# EAGLE design R141E (EAGLE 6.6.0)
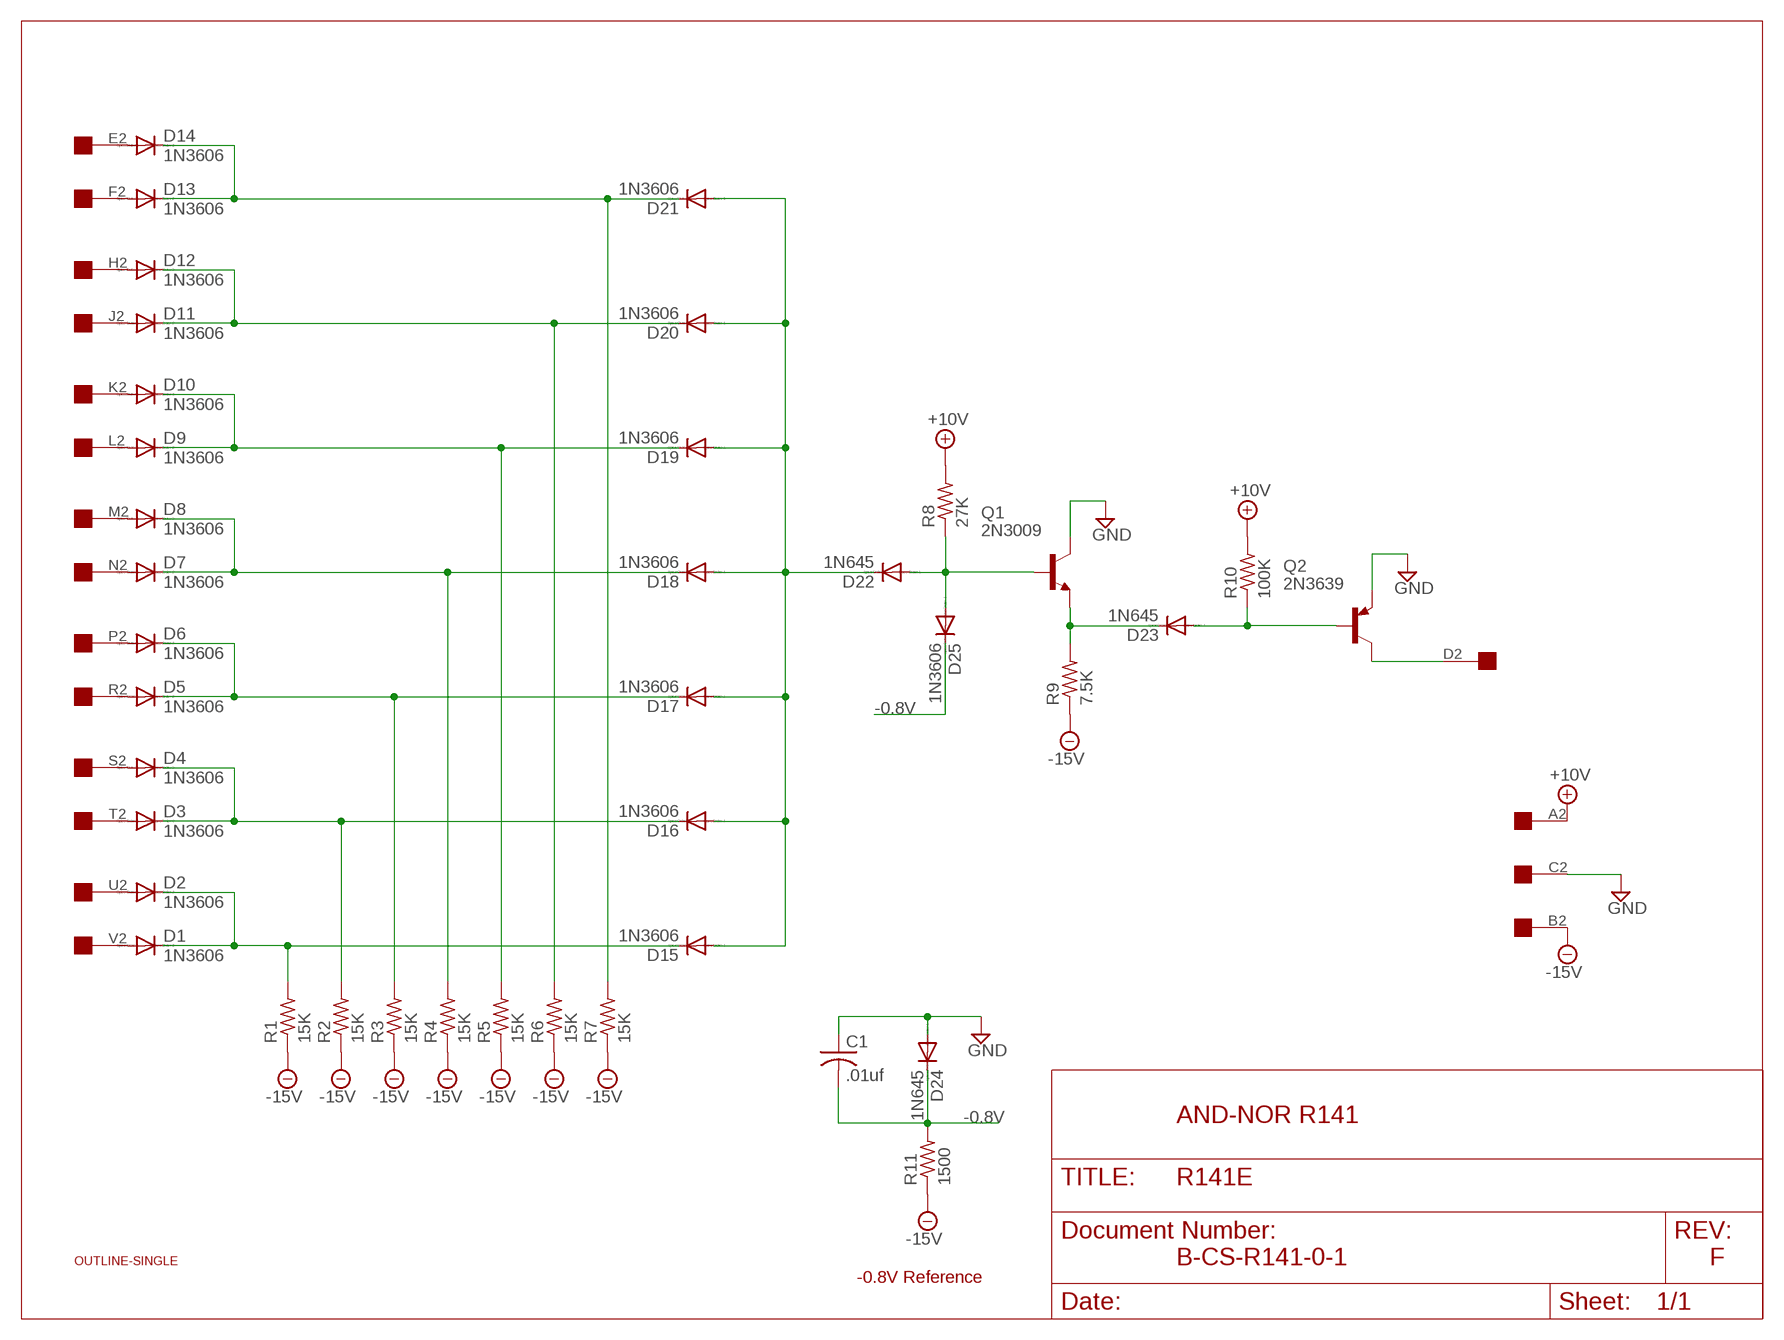
[diagram p0: schematic, sheet 1]

## Parts
C1  .01uf  C-US050-025X075  [C050-025X075]
D1  1N3606  1N4148DO35-10  [DO35-10]
D2  1N3606  1N4148DO35-10  [DO35-10]
D3  1N3606  1N4148DO35-10  [DO35-10]
D4  1N3606  1N4148DO35-10  [DO35-10]
D5  1N3606  1N4148DO35-10  [DO35-10]
D6  1N3606  1N4148DO35-10  [DO35-10]
D7  1N3606  1N4148DO35-10  [DO35-10]
D8  1N3606  1N4148DO35-10  [DO35-10]
D9  1N3606  1N4148DO35-10  [DO35-10]
D10  1N3606  1N4148DO35-10  [DO35-10]
D11  1N3606  1N4148DO35-10  [DO35-10]
D12  1N3606  1N4148DO35-10  [DO35-10]
D13  1N3606  1N4148DO35-10  [DO35-10]
D14  1N3606  1N4148DO35-10  [DO35-10]
D15  1N3606  1N4148DO35-10  [DO35-10]
D16  1N3606  1N4148DO35-10  [DO35-10]
D17  1N3606  1N4148DO35-10  [DO35-10]
D18  1N3606  1N4148DO35-10  [DO35-10]
D19  1N3606  1N4148DO35-10  [DO35-10]
D20  1N3606  1N4148DO35-10  [DO35-10]
D21  1N3606  1N4148DO35-10  [DO35-10]
D22  1N645  1N4148DO35-10  [DO35-10]
D23  1N645  1N4148DO35-10  [DO35-10]
D24  1N645  1N4148DO35-10  [DO35-10]
D25  1N3606  1N4148DO35-10  [DO35-10]
Q1  2N3009  2N3019-NPN-TO39-EBC  [TO39]
Q2  2N3639  2N3637  [TO39]
R1  15K  R-US_0207/10  [0207/10]
R2  15K  R-US_0207/10  [0207/10]
R3  15K  R-US_0207/10  [0207/10]
R4  15K  R-US_0207/10  [0207/10]
R5  15K  R-US_0207/10  [0207/10]
R6  15K  R-US_0207/10  [0207/10]
R7  15K  R-US_0207/10  [0207/10]
R8  27K  R-US_0207/10  [0207/10]
R9  7.5K  R-US_0207/10  [0207/10]
R10  100K  R-US_0207/10  [0207/10]
R11  1500  R-US_0207/10  [0207/10]
U$1  OUTLINE-SINGLE  [SINGLE]
U$2  EDGE-1  [EDGE-CON1]

## Nets
+10V [Power]: R8.2 R10.2 U$2.A2
-0.8V [Power]: C1.2 D24.C D25.C R11.2
-15V [Power]: R1.1 R2.1 R3.1 R4.1 R5.1 R6.1 R7.1 R9.1 R11.1 U$2.B2
GND [Power]: C1.1 D24.A Q1.3(C) Q2.1(E) U$2.C2
N$1: D4.A U$2.S2
N$2: D23.A Q2.2(B) R10.1
N$3: D22.A D25.A Q1.2(B) R8.1
N$4: Q2.3(C) U$2.D2
N$5: D11.A U$2.J2
N$6: D11.C D12.C D20.C R6.2
N$7: D10.A U$2.K2
N$8: D2.A U$2.U2
N$9: D8.A U$2.M2
N$10: D9.A U$2.L2
N$11: D9.C D10.C D19.C R5.2
N$12: D6.A U$2.P2
N$13: D23.C Q1.1(E) R9.2
N$14: D1.A U$2.V2
N$15: D15.A D16.A D17.A D18.A D19.A D20.A D21.A D22.C
N$17: D1.C D2.C D15.C R1.2
N$20: D14.A U$2.E2
N$21: D13.A U$2.F2
N$22: D13.C D14.C D21.C R7.2
N$23: D12.A U$2.H2
N$26: D7.A U$2.N2
N$27: D7.C D8.C D18.C R4.2
N$31: D5.A U$2.R2
N$32: D5.C D6.C D17.C R3.2
N$36: D3.A U$2.T2
N$37: D3.C D4.C D16.C R2.2

## Notes on the sheet
- AND-NOR R141
- B-CS-R141-0-1 | F
- -0.8V Reference

## Library data of the parts
C1 = rcl:C-US: CAPACITOR, American symbol
D1-D25 = diode:1N4148: DIODE high speed (Philips)
Q1 = transistor:*-NPN-: NPN Transistror BF959 corrected 2008.03.06
Q2 = transistor-pnp:2N3637*: PNP Transistror
R1-R11 = rcl:R-US_: RESISTOR, American symbol
U$1 = dec-con:OUTLINE-*: Board outlines for DEC boards.
U$2 = dec-con:EDGE-1: Single-Sided DEC Edge Connector -- (side 2)

## Net classes
1 Power: width 0.813 mm

## Board
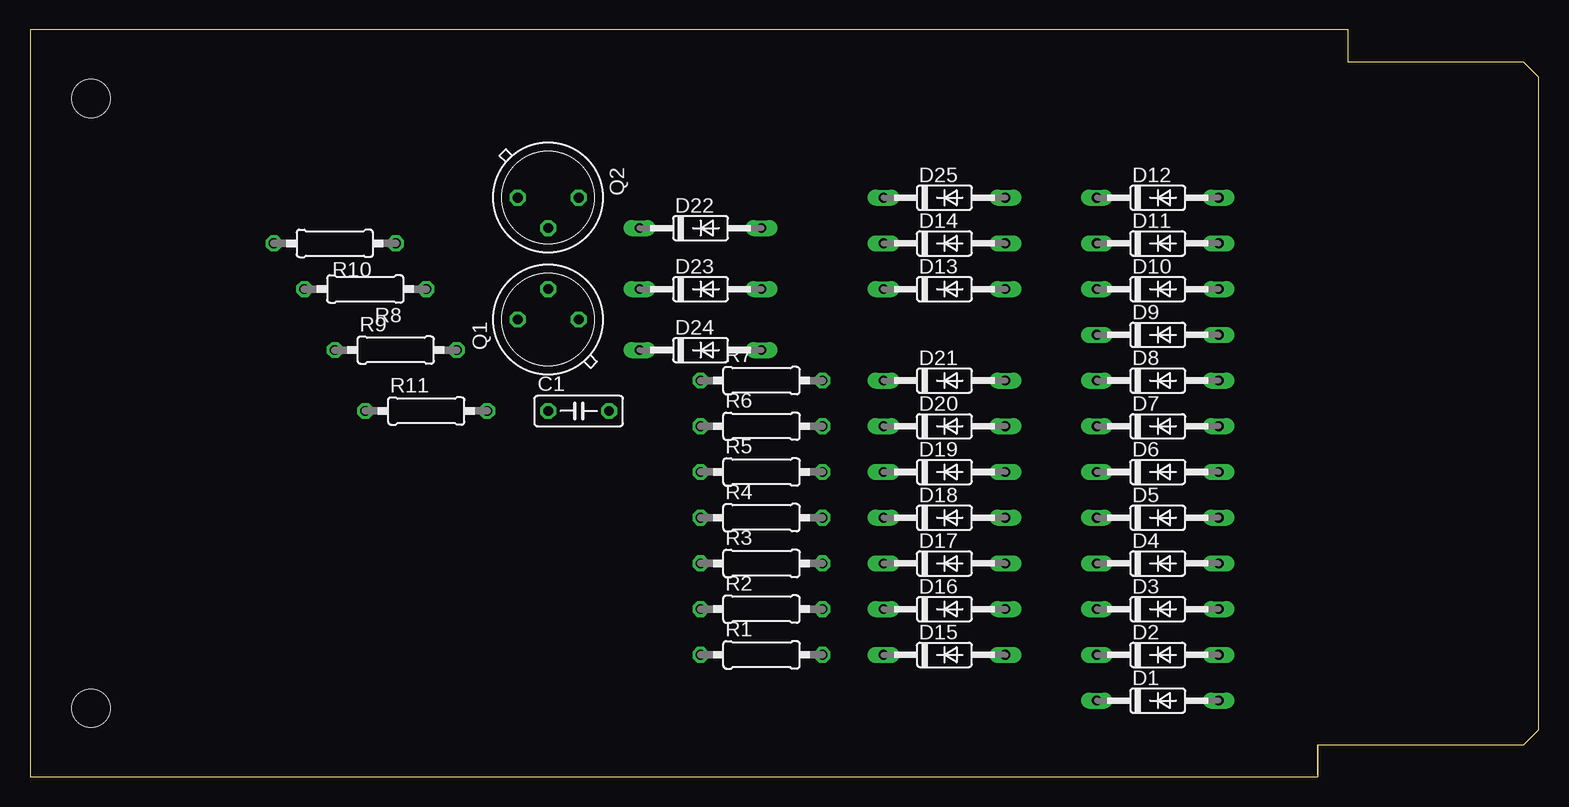
[diagram p1: board, top side]
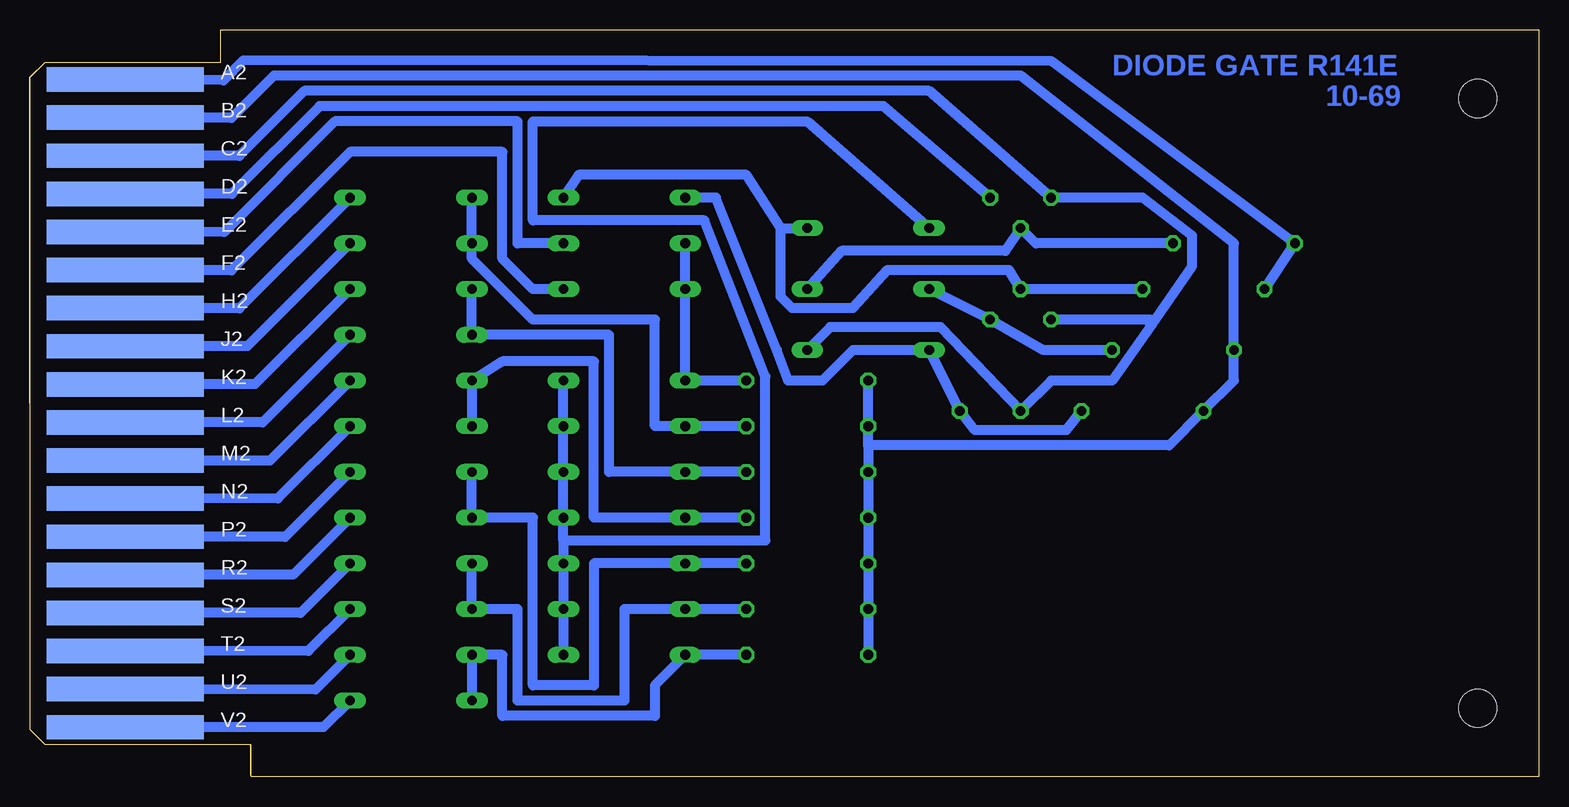
[diagram p2: board, bottom side, seen from below]

Size 125.73 x 62.23 mm. Coordinates in mm from the lower left corner, seen from the top.
Copper layers (1+16): Top 0.035mm / dielectric 1.5mm / Bottom 0.035mm
Design rules "16mils": minimum track width 16mil, minimum drill 32mil, track to track 15mil, track to pad 10mil, pad to pad 10mil, via to via 10mil, smd to smd 10mil, copper to edge 13mil, drill to drill 10mil, minimum pad ring 10mil, minimum via ring 8mil, stop-mask expansion 0mil, vias tented up to drill 0mil, thermal gap 10mil

### Footprints (pad centres in the part's own frame; a part is rotated, then mirrored left to right if it is on the bottom)
C050-025X075 = drill 0.813 octagon: 1 -2.54,0; 2 2.54,0
DO35-10 = drill 0.813 long: A 5.08,0; C -5.08,0
TO39 = drill 0.813 octagon: 1 0,-2.54; 2 2.54,0; 3 0,2.54
0207/10 = drill 0.813 octagon: 1 -5.08,0; 2 5.08,0
SINGLE = hole 3.175: 120.65,56.515; 120.65,5.715
EDGE-CON1 = smd 13.106 x 2.032 bottom: A2 7.938,4.128; B2 7.938,7.303; C2 7.938,10.477; D2 7.938,13.652; E2 7.938,16.828; F2 7.938,20.003; H2 7.938,23.177; J2 7.938,26.352; K2 7.938,29.527; L2 7.938,32.703; M2 7.938,35.877; N2 7.938,39.053; P2 7.938,42.227; R2 7.938,45.403; S2 7.938,48.578; T2 7.938,51.752; U2 7.938,54.928; V2 7.938,58.102

### Placement (x,y rotation side)
C1  45.72,30.48 0 top
D1  93.98,6.35 0 top
D2  93.98,10.16 0 top
D3  93.98,13.97 0 top
D4  93.98,17.78 0 top
D5  93.98,21.59 0 top
D6  93.98,25.4 0 top
D7  93.98,29.21 0 top
D8  93.98,33.02 0 top
D9  93.98,36.83 0 top
D10  93.98,40.64 0 top
D11  93.98,44.45 0 top
D12  93.98,48.26 0 top
D13  76.2,40.64 0 top
D14  76.2,44.45 0 top
D15  76.2,10.16 0 top
D16  76.2,13.97 0 top
D17  76.2,17.78 0 top
D18  76.2,21.59 0 top
D19  76.2,25.4 0 top
D20  76.2,29.21 0 top
D21  76.2,33.02 0 top
D22  55.88,45.72 0 top
D23  55.88,40.64 0 top
D24  55.88,35.56 0 top
D25  76.2,48.26 0 top
Q1  43.18,38.1 90 top
Q2  43.18,48.26 270 top
R1  60.96,10.16 0 top
R2  60.96,13.97 0 top
R3  60.96,17.78 0 top
R4  60.96,21.59 0 top
R5  60.96,25.4 0 top
R6  60.96,29.21 0 top
R7  60.96,33.02 0 top
R8  27.94,40.64 180 top
R9  30.48,35.56 0 top
R10  25.4,44.45 180 top
R11  33.02,30.48 0 top
U$1  125.73,62.23 180 top
U$2  125.73,62.23 180 top

### Tracks (layer width: path | path; a pad name or v marks a point on that pad's centre or on a via)
+10V
  Bottom 0.813: R8.2 R10.2 40.57,59.62 107.95,59.69 109.6,58.04 U$2.A2
-0.8V
  Bottom 0.813: R11.2 39.37,28.89 46.99,28.89 C1.2 D24.C 57.15,35.56 59.69,33.02 62.55,33.02 63.5,35.56 68.58,48.26 D25.C
-15V
  Bottom 0.813: R1.1 R2.1 R3.1 R4.1 R5.1 55.88,27.62 | R7.1 R6.1 55.88,27.62 | 55.88,27.62 30.8,27.62 R11.1 25.4,33.02 R9.1 25.4,44.45 43.18,58.42 105.41,58.42 108.93,54.9 U$2.B2
GND
  Bottom 0.813: U$2.C2 108.28,51.74 102.87,57.15 50.8,57.15 Q2.1 33.02,48.26 28.89,45.09 28.89,42.55 32.23,37.67 | D24.A 59.05,37.47 49.85,37.47 C1.1 40.64,33.02 35.56,33.02 32.23,37.67 | 32.23,37.67 32.38,37.67 32.38,38.1 Q1.3
N$1
  Bottom 0.813: U$2.S2 103.17,13.66 D4.A
N$2
  Bottom 0.813: R10.1 41.91,44.45 Q2.2 44.45,43.81 58.1,43.81 D23.A
N$3
  Bottom 0.813: R8.1 Q1.2 44.13,42.23 54.29,42.23 57.15,39.05 62.23,39.05 63.18,40.01 63.18,45.72 | 63.18,45.72 66.04,50.16 80.01,50.16 D25.A | 63.18,45.72 D22.A
N$4
  Bottom 0.813: U$2.D2 108.92,48.56 101.6,55.88 54.61,55.88 Q2.3
N$5
  Bottom 0.813: U$2.J2 107.62,35.89 D11.A
N$6
  Bottom 0.813: R6.2 D20.C 73.66,29.21 73.66,38.1 83.82,38.1 88.9,43.18 D11.C D12.C
N$7
  Bottom 0.813: U$2.K2 106.98,32.72 D10.A
N$8
  Bottom 0.813: U$2.U2 101.96,7.26 D2.A
N$9
  Bottom 0.813: U$2.M2 105.74,26.34 D8.A
N$10
  Bottom 0.813: U$2.L2 106.35,29.54 D9.A
N$11
  Bottom 0.813: R5.2 D19.C 77.47,25.4 77.47,36.83 D9.C D10.C
N$12
  Bottom 0.813: U$2.P2 104.47,19.99 D6.A
N$13
  Bottom 0.813: R9.2 41.27,35.56 Q1.1 D23.C
N$14
  Bottom 0.813: U$2.V2 101.28,4.13 D1.A
N$15
  Bottom 0.813: D15.A D16.A D17.A 81.28,19.68 | 81.28,19.68 D18.A D19.A D20.A D21.A | D22.C 60.96,54.61 83.82,54.61 83.82,46.35 69.53,46.35 64.45,33.34 64.45,19.68 81.28,19.68
N$17
  Bottom 0.813: R1.2 D15.C 73.66,7.62 73.66,5.08 86.36,5.08 86.36,10.16 D2.C D1.C
N$20
  Bottom 0.813: U$2.E2 109.55,45.39 100.33,54.61 85.09,54.61 85.09,44.45 D14.A
N$21
  Bottom 0.813: U$2.F2 108.94,42.19 99.06,52.07 86.36,52.07 86.36,43.18 83.82,40.64 D13.A
N$22
  Bottom 0.813: D14.C D13.C D21.C R7.2
N$23
  Bottom 0.813: U$2.H2 108.28,39.04 D12.A
N$26
  Bottom 0.813: U$2.N2 105.08,23.19 D7.A
N$27
  Bottom 0.813: R4.2 D18.C 78.74,21.59 78.74,34.61 86.36,34.61 D8.C D7.C
N$31
  Bottom 0.813: U$2.R2 103.81,16.84 D5.A
N$32
  Bottom 0.813: R3.2 D17.C 78.74,17.78 78.74,7.62 83.82,7.62 83.82,21.59 D5.C D6.C
N$36
  Bottom 0.813: U$2.T2 102.54,10.49 D3.A
N$37
  Bottom 0.813: R2.2 D16.C 76.2,13.97 76.2,6.35 85.09,6.35 85.09,13.97 D3.C D4.C

### Text on the board
Bottom: DIODE GATE R141E | 10-69